# Altium schematic sheet power.SchDoc
size A3; SheetNumber: 4; SheetTotal: 5
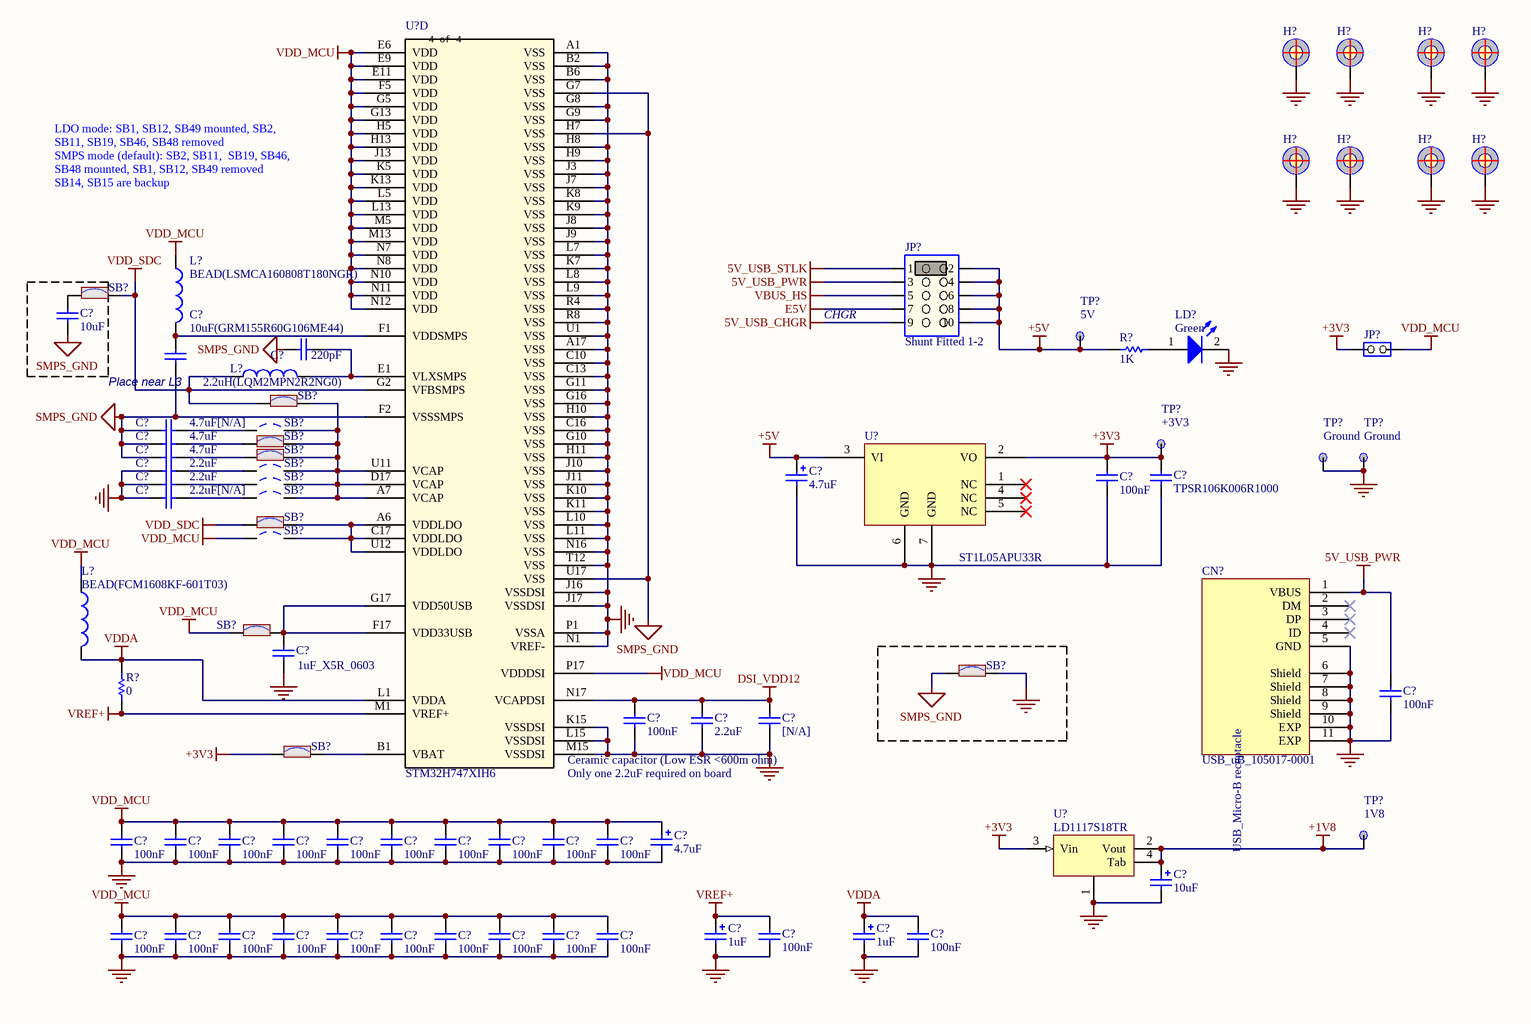
[diagram p0: power.SchDoc]

## Parts
(Parts that share a designator on the sheet are numbered #1, #2 ... from top to bottom, then left to right.)
C?#1  10uF  [CAP_C_1608X80]
C?#2  10uF(GRM155R60G106ME44)  [CAP_C_1608X80]
C?#3  220pF  [CAP_C_1608X80]
C?#4  4.7uF[N/A]  [CAP_C_1608X80]
C?#5  4.7uF  [CAP_C_1608X80]
C?#6  4.7uF  [CAP_C_1608X80]
C?#7  2.2uF  [CAP_C_1608X80]
C?#8  2.2uF  [CAP_C_1608X80]
C?#9  4.7uF  [TAN-A]
C?#10  100nF  [CAP_C_1608X80]
C?#11  2.2uF[N/A]  [CAP_C_1608X80]
C?#12  TPSR106K006R1000  [CAP_C_1608X80]
C?#13  1uF_X5R_0603  [0603C]
C?#14  100nF  [0402C]
C?#15  100nF  [CAP_C_1608X80]
C?#16  2.2uF  [CAP_C_1608X80]
C?#17  [N/A]  [CAP_C_1608X80]
C?#18  100nF  [CAP_C_1608X80]
C?#19  100nF  [CAP_C_1608X80]
C?#20  100nF  [CAP_C_1608X80]
C?#21  100nF  [CAP_C_1608X80]
C?#22  100nF  [CAP_C_1608X80]
C?#23  100nF  [CAP_C_1608X80]
C?#24  100nF  [CAP_C_1608X80]
C?#25  100nF  [CAP_C_1608X80]
C?#26  100nF  [CAP_C_1608X80]
C?#27  100nF  [CAP_C_1608X80]
C?#28  4.7uF  [TAN-A]
C?#29  10uF  [TAN-A]
C?#30  100nF  [CAP_C_1608X80]
C?#31  100nF  [CAP_C_1608X80]
C?#32  100nF  [CAP_C_1608X80]
C?#33  100nF  [CAP_C_1608X80]
C?#34  100nF  [CAP_C_1608X80]
C?#35  100nF  [CAP_C_1608X80]
C?#36  100nF  [CAP_C_1608X80]
C?#37  100nF  [CAP_C_1608X80]
C?#38  100nF  [CAP_C_1608X80]
C?#39  100nF  [CAP_C_1608X80]
C?#40  1uF  [TAN-A]
C?#41  1uF  [TAN-A]
C?#42  100nF  [CAP_C_1608X80]
C?#43  100nF  [CAP_C_1608X80]
CN?  value USB_uB_105017-0001  [MOLEX_1050170001]  (hidden comment: USB_uB_105017.0001)
H?#1  POSITION HOLE C6D3R5  [HOLE_C7D3R5]  (value not drawn)
H?#2  POSITION HOLE C6D3R5  [HOLE_C7D3R5]  (value not drawn)
H?#3  POSITION HOLE C6D3R5  [HOLE_C9D4R5]  (value not drawn)
H?#4  POSITION HOLE C6D3R5  [HOLE_C9D4R5]  (value not drawn)
H?#5  POSITION HOLE C6D3R5  [HOLE_C7D3R5]  (value not drawn)
H?#6  POSITION HOLE C6D3R5  [HOLE_C7D3R5]  (value not drawn)
H?#7  POSITION HOLE C6D3R5  [HOLE_C9D4R5]  (value not drawn)
H?#8  POSITION HOLE C6D3R5  [HOLE_C9D4R5]  (value not drawn)
JP?#1  value Shunt Fitted 1-2  [JP5-D2T]  (hidden comment: Jumper_Header 5x2 Fitted 1-2)
JP?#2  (no value)  [JP2-D1T]
L?#1  BEAD(LSMCA160808T180NGR)  [0603L]
L?#2  2.2uH(LQM2MPN2R2NG0)  [LSM2_VLS2016E_S]
L?#3  BEAD(FCM1608KF-601T03)  [0603L]
LD?  Green  [0603D]
R?#1  1K  [0603R]
R?#2  0  [0603R]
SB?#1  Solder Bridge ON  [Jump2]  (value not drawn)
SB?#2  Solder Bridge ON  [Jump2]  (value not drawn)
SB?#3  Solder Bridge OFF  [SB_0603]  (value not drawn)
SB?#4  Solder Bridge ON  [Jump2]  (value not drawn)
SB?#5  Solder Bridge ON  [Jump2]  (value not drawn)
SB?#6  Solder Bridge OFF  [SB_0603]  (value not drawn)
SB?#7  Solder Bridge OFF  [SB_0603]  (value not drawn)
SB?#8  Solder Bridge OFF  [SB_0603]  (value not drawn)
SB?#9  Solder Bridge ON  [Jump2]  (value not drawn)
SB?#10  Solder Bridge OFF  [SB_0603]  (value not drawn)
SB?#11  Solder Bridge ON  [Jump2]  (value not drawn)
SB?#12  Solder Bridge ON  [Jump2]  (value not drawn)
SB?#13  Solder Bridge ON  [Jump2]  (value not drawn)
TP?#1  5V  [TP_C40]
TP?#2  +3V3  [TP_C40]
TP?#3  Ground  [TP_C40]
TP?#4  Ground  [TP_C40]
TP?#5  1V8  [TP_C40]
U?#1  STM32H747XIH6  [TFBGA240+25]  (part D of 4)
U?#2  ST1L05APU33R  [SON95P300X300X100-7N]
U?#3  LD1117S18TR  [SOT230P700X180-4N]

## Nets
5V_USB_CHGR: JP?#1.9
5V_USB_PWR: C?#14.2 CN?.1(VBUS) JP?#1.3
5V_USB_STLK: JP?#1.1
+1V8: C?#29.1 TP?#5.1 U?#3.2(Vout) U?#3.4(Tab)
+3V3: C?#10.1 C?#12.2 JP?#2.1(COMMON) SB?#13.1 TP?#2.1 U?#2.2(VO) U?#3.3(Vin)
+5V: C?#9.1 JP?#1.2 JP?#1.4 JP?#1.6 JP?#1.8 JP?#1.10 R?#1.2 TP?#1.1 U?#2.3(VI)
DSI_VDD12: C?#15.1 C?#16.1 C?#17.2 U?#1.N17(VCAPDSI)
E5V: JP?#1.7
GND: C?#7.1 C?#8.1 C?#9.2 C?#10.2 C?#11.1 C?#12.1 C?#13.1 C?#14.1 C?#15.2 C?#16.2 C?#17.1 C?#18.2 C?#19.2 C?#20.2 C?#21.2 C?#22.2 C?#23.2 C?#24.2 C?#25.2 C?#26.2 C?#27.2 C?#28.2 C?#29.2 C?#30.2 C?#31.2 C?#32.2 C?#33.2 C?#34.2 C?#35.2 C?#36.2 C?#37.2 C?#38.2 C?#39.2 C?#40.2 C?#41.2 C?#42.1 C?#43.1 CN?.5(GND) CN?.6(Shield) CN?.7(Shield) CN?.8(Shield) CN?.9(Shield) CN?.10(EXP) CN?.11(EXP) H?#1.1 H?#2.1 H?#3.1 H?#4.1 H?#5.1 H?#6.1 H?#7.1 H?#8.1 LD?.2(K) SB?#12.2 TP?#3.1 TP?#4.1 U?#1.A1(VSS) U?#1.A17(VSS) U?#1.B2(VSS) U?#1.B6(VSS) U?#1.C10(VSS) U?#1.C13(VSS) U?#1.C16(VSS) U?#1.G8(VSS) U?#1.G9(VSS) U?#1.G10(VSS) U?#1.G11(VSS) U?#1.G16(VSS) U?#1.H8(VSS) U?#1.H9(VSS) U?#1.H10(VSS) U?#1.H11(VSS) U?#1.J3(VSS) U?#1.J7(VSS) U?#1.J8(VSS) U?#1.J9(VSS) U?#1.J10(VSS) U?#1.J11(VSS) U?#1.J16(VSSDSI) U?#1.J17(VSSDSI) U?#1.K7(VSS) U?#1.K8(VSS) U?#1.K9(VSS) U?#1.K10(VSS) U?#1.K11(VSS) U?#1.K15(VSSDSI) U?#1.L7(VSS) U?#1.L8(VSS) U?#1.L9(VSS) U?#1.L10(VSS) U?#1.L11(VSS) U?#1.L15(VSSDSI) U?#1.M15(VSSDSI) U?#1.N1(VREF-) U?#1.N16(VSS) U?#1.P1(VSSA) U?#1.R4(VSS) U?#1.R8(VSS) U?#1.T12(VSS) U?#1.U1(VSS) U?#2.6(GND) U?#2.7(GND) U?#3.1
SMPS_GND: C?#1.1 C?#2.1 C?#3.2 C?#4.1 C?#5.1 C?#6.1 SB?#12.1 U?#1.F2(VSSSMPS) U?#1.G7(VSS) U?#1.H7(VSS) U?#1.U17(VSS)
VBUS_HS: JP?#1.5
VDD_MCU: C?#18.1 C?#19.1 C?#20.1 C?#21.1 C?#22.1 C?#23.1 C?#24.1 C?#25.1 C?#26.1 C?#27.1 C?#28.1 C?#30.1 C?#31.1 C?#32.1 C?#33.1 C?#34.1 C?#35.1 C?#36.1 C?#37.1 C?#38.1 C?#39.1 JP?#2.2(NO) L?#1.1 L?#3.1 SB?#10.1 SB?#11.1 U?#1.E6(VDD) U?#1.E9(VDD) U?#1.E11(VDD) U?#1.F5(VDD) U?#1.G5(VDD) U?#1.G13(VDD) U?#1.H5(VDD) U?#1.H13(VDD) U?#1.J13(VDD) U?#1.K5(VDD) U?#1.K13(VDD) U?#1.L5(VDD) U?#1.L13(VDD) U?#1.M5(VDD) U?#1.M13(VDD) U?#1.N7(VDD) U?#1.N8(VDD) U?#1.N10(VDD) U?#1.N11(VDD) U?#1.N12(VDD) U?#1.P17(VDDDSI)
VDD_SDC: L?#2.1 SB?#1.2 SB?#2.1 SB?#9.1 U?#1.G2(VFBSMPS)
VDDA: C?#41.1 C?#43.2 L?#3.2 R?#2.1 U?#1.L1(VDDA)
VREF+: C?#40.1 C?#42.2 R?#2.2 U?#1.M1(VREF+)
NetC?#1_2: C?#1.2 SB?#1.1
NetC?#2_2: C?#2.2 L?#1.2 U?#1.F1(VDDSMPS)
NetC?#3_1: C?#3.1 L?#2.2 U?#1.E1(VLXSMPS)
NetC?#4_2: C?#4.2 SB?#3.1
NetC?#5_2: C?#5.2 SB?#4.1
NetC?#6_2: C?#6.2 SB?#5.1
NetC?#7_2: C?#7.2 SB?#6.1
NetC?#8_2: C?#8.2 SB?#7.1
NetC?#11_2: C?#11.2 SB?#8.1
NetC?#13_2: C?#13.2 SB?#11.2 U?#1.F17(VDD33USB) U?#1.G17(VDD50USB)
NetLD?_1: LD?.1(A) R?#1.1
NetSB?#2_2: SB?#2.2 SB?#3.2 SB?#4.2 SB?#5.2 SB?#6.2 SB?#7.2 SB?#8.2 U?#1.A7(VCAP) U?#1.D17(VCAP) U?#1.U11(VCAP)
NetSB?#9_2: SB?#9.2 SB?#10.2 U?#1.A6(VDDLDO) U?#1.C17(VDDLDO) U?#1.U12(VDDLDO)
NetSB?#13_2: SB?#13.2 U?#1.B1(VBAT)

Not connected (* = marked no-connect by the designer): CN? 2(DM)* 3(DP)* 4(ID)*; U?#2 1(NC)* 4(NC)* 5(NC)*

## Notes on the sheet
- LDO mode: SB1, SB12, SB49 mounted, SB2, SB11, SB19, SB46, SB48 removed
  SMPS mode (default): SB2, SB11,  SB19, SB46, SB48 mounted, SB1, SB12, SB49 removed
  SB14, SB15 are backup
- CHGR
- Place near L3
- (near U?#1) Ceramic capacitor (Low ESR <600m ohm)
- (near U?#1) Only one 2.2uF required on board
- (in symbol MCD-00028) USB_Micro-B receptacle
- (in symbol STM32H747XIH6, part D) 4 of 4

## Library data of the parts
C?#1-C?#3 C?#5-C?#8 C?#42 C?#43 = Cap: Capacitor; Value: 10nF; Published: 8-Jun-2000; Revision: July-2002: Re-released for DXP Platform.; Publisher: Altium Limited
C?#4 = cap: Capacitor; Value: 100nF; Ordered by: Subcon; ECCN_US/EU: NA; Fitted: NO; Published: 8-Jun-2000; Revision: July-2002: Re-released for DXP Platform.; Publisher: Altium Limited
C?#9 = Cap Pol1: Polarized Capacitor (Radial); Value: 100pF; Ordered by: Subcon; ECCN_US/EU: NA; Published: 8-Jun-2000; Revision: July-2002: Re-released for DXP Platform.; Publisher: Altium Limited
C?#10 = Cap: Capacitor; Value: 10nF; Ordered by: Subcon; ECCN_US/EU: NA; Published: 8-Jun-2000; Revision: July-2002: Re-released for DXP Platform.; Publisher: Altium Limited
C?#11 = Cap: Capacitor; Value: 10nF; Fitted: NO; Published: 8-Jun-2000; Revision: July-2002: Re-released for DXP Platform.; Publisher: Altium Limited
C?#12 = Cap: Capacitor; Manuf_1: AVX; Ordered by: Subcon; ECCN_US/EU: NA; Revision: V1.0; Manuf_Part_1: TPSR106K006R1000; Value: TPSR106K006R1000
C?#13 = CAP SMD 0603  X5R 1礔 25V 10%: 0603  X5R 1礔; Rated voltage: 25V; Tolerance: 10%; Manufacturer: *; Manufacturer P/N: *; Order code Farnell: 1288202RL; Value: 1礔; Power: *; Technology: X5R; Temperature  Factor: *; Temperature Max: +125癈; Temperature Min: -55癈; STS Code: *
C?#14 = MCD-00016: Capacitor,20pF,50V,NPO,5%,0402; Manufacturer_Part_Number: CC0402JRNPO9BN200; Manufacturer: YAGEO; Provided_By: Subcon; Initial_Board_Reference: mb1274; Internal_Part_Number: MCD-00016; Value: 100nF; Status: Released; Package: 0402; ComponentLink1Description: Yageo_Capacitor_NP0_16V-to-50V.pdf; ECCN_US: n/a; ECCN_EU: n/a; Part_Type: Capacitor
C?#15 C?#18-C?#27 C?#30-C?#39 = CAP: Capacitor; Published: 8-Jun-2000; Revision: July-2002: Re-released for DXP Platform.; Publisher: Altium Limited; Value: 100nF
C?#16 = CAP: Capacitor; Value: 100nF; Published: 8-Jun-2000; Revision: July-2002: Re-released for DXP Platform.; Publisher: Altium Limited
C?#17 = cap: Capacitor; Value: 2.2uF; Ordered by: Subcon; ECCN_US/EU: NA; Fitted: NO; Published: 8-Jun-2000; Revision: July-2002: Re-released for DXP Platform.; Publisher: Altium Limited
C?#28 = Cap Pol1: Polarized Capacitor (Radial); Value: 47uF; Published: 8-Jun-2000; Revision: July-2002: Re-released for DXP Platform.; Publisher: Altium Limited
C?#29 = Cap_10uF_POL_10%_TANA: Polarized Capacitor,10uF,10V,10%,typeA,VISHAY; Manuf_Part_1: 293D106X9010A2TE3; Revision: July-2002: Re-released for DXP Platform.; Value: 10uF; Manuf_1: VISHAY; Order: *; ECCN_US/EU: n/a
C?#40 C?#41 = Cap Pol1: Polarized Capacitor (Radial); Value: 10uF; Published: 8-Jun-2000; Revision: July-2002: Re-released for DXP Platform.; Publisher: Altium Limited
CN? = MCD-00028: USB-MICRO-B, 0.65mm, RA, SMT, Bottom Mount,; Manufacturer_Part_Number: 1050170001; Manufacturer: MOLEX; Part_Type: Connector; Provided_By: Subcon; Initial_Board_Reference: mb1274; Internal_Part_Number: MCD-00028; Status: Released; ComponentLink1Description: Molex_Connector-USB-uB_1050170001.pdf; ECCN_US: n/a; ECCN_EU: n/a
H?#1-H?#8 = POSITION HOLE C6D3R5: Fitted: NO
JP?#1 = MCD-01203: Header, 5x2, 2,54mm, VR, TH, Height 5.84mm/2.54mm - Shunt Fitted 1-2; Part_Type: Connector; Manufacturer_Part_Number: TSW-105-07-x-D; Manufacturer: SAMTEC; Provided_By: Subcon; Initial_Board_Reference: Mb1372; Internal_Part_Number: MCD-01203; Status: Symbol available; ComponentLink1Description: Samtec_TSW-HTSW-series.pdf; ComponentLink1URL: http://tunmcdsvn.tun.st.com/Component_Datasheet_Library/Trunk/Connectors/Samtec_TSW-HTSW-series; ECCN_US: n/a; ECCN_EU: n/a
JP?#2 = JP2
L?#1-L?#3 = Inductor: Value: 100uH; Published: 8-Jun-2000; Revision: July-2002: Re-released for DXP Platform.; Publisher: Altium Limited
  L?#1: MPN: LSMCA160808T180NGR
LD? = LED2: Typical RED, GREEN, YELLOW, AMBER GaAs LED; Published: 8-Jun-2000; Revision: July-2002: Re-released for DXP Platform.; Publisher: Altium Limited
R?#1 = res1: Resistor; Published: 8-Jun-2000; Revision: July-2002: Re-released for DXP Platform.; Publisher: Altium Limited; Value: 1K
R?#2 = Res1: Resistor; Value: 1K; Published: 8-Jun-2000; Revision: July-2002: Re-released for DXP Platform.; Publisher: Altium Limited
SB?#1 SB?#2 SB?#4 SB?#5 SB?#9 SB?#11-SB?#13 = SB_ON: Fitted: YES; Ordered by: Subcon; Revision: July-2002: Re-released for DXP Platform.; ECCN_US/EU: n/a
SB?#3 SB?#6-SB?#8 SB?#10 = SB_OFF: Fitted: NO; Ordered by: Subcon; Revision: July-2002: Re-released for DXP Platform.; ECCN_US/EU: n/a
TP?#1-TP?#5 = TP
U?#1 = STM32H747XIH6: High-performance and DSP with DP-FPU, Arm Cortex-M7 + Cortex-M4 MCU with 2MBytes of Flash memory, 1MB RAM, 480 MHz CPU, Art Accelerator, L1 cache, external memory interface, large set of peripherals, SMPS; Manufacturer_Name: STMicroelectronics; Copyright: Copyright (C) 2025 Ultra Librarian. All rights reserved.; Manufacturer_Part_Number: STM32H747XIH6; Datasheet: https://www.st.com/resource/en/datasheet/stm32h747ag.pdf; RefDes: RefDes; Type: Type
U?#2 = ST1L05A: Ordered by: STM; ECCN_US/EU: EAR99/NEC; Fitted: YES; Manuf_1: STM; Manuf_Part_1: ST1L05APU33R
U?#3 = LD1117: Ordered by: STM; ECCN_US/EU: EAR99/NEC; Fitted: YES; Manuf_1: STM; Manuf_Part_1: LD1117S18TR